# Altium schematic sheet 6-E2p&RTC.SchDoc
size A4
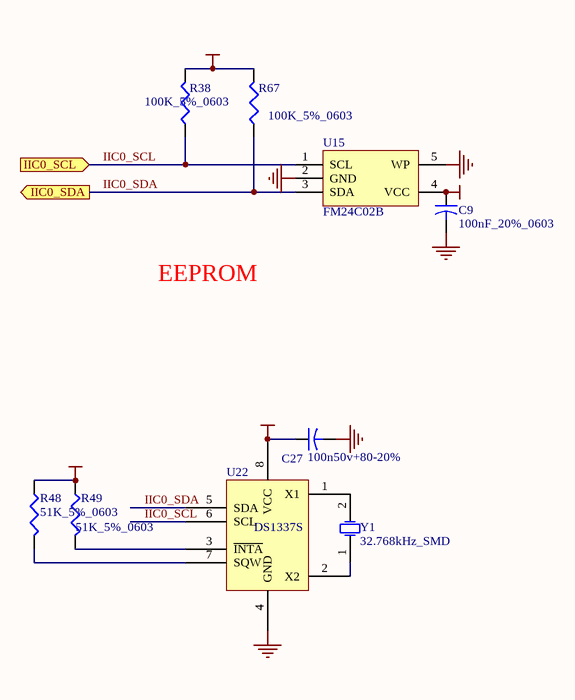
[diagram p0: 6-E2p&RTC.SchDoc]

## Parts
C9  100nF_20%_0603  [C1608-0603]
C27  value 100n50v+80-20%  [C1608-0603]  (hidden comment: Cap2)
R38  100K_5%_0603  [C1608-0603]
R48  51K_5%_0603  [C1608-0603]
R49  51K_5%_0603  [C1608-0603]
R67  100K_5%_0603  [C1608-0603]
U15  FM24C02B  [SOT23-5]
U22  DS1337S  [SO-8]
Y1  32.768kHz_SMD  [XTAL-3216]

## Ports
IIC0_SCL (in), IIC0_SDA (out)

## Nets
GND: C9.2 C27.2 U15.2(GND) U15.5(WP) U22.4(GND)
VCC_2V8: C9.1 C27.1 R38.2 R48.1 R49.1 R67.2 U15.4(VCC) U22.8(VCC)
IIC0_SCL: R38.1 U15.1(SCL) U22.6(SCL) ; port IIC0_SCL
IIC0_SDA: R67.1 U15.3(SDA) U22.5(SDA) ; port IIC0_SDA
NetR48_2: R48.2 U22.7(SQW)
NetR49_2: R49.2 U22.3(~{INTA})
NetU22_1: U22.1(X1) Y1.2(OSC2)
NetU22_2: U22.2(X2) Y1.1(OSC1)

## Notes on the sheet
- EEPROM

## Library data of the parts
C9 = Cap2: Capacitor; Value: 0.1uF 0603; Published: 23-Sep-2002; Publisher: Altium Limited
C27 = Cap2: Capacitor; Published: 23-Sep-2002; Publisher: Altium Limited
R38 R48 R49 R67 = Res3: Resistor; Value: 1K%5 0603; Published: 8-Jun-2000; Revision: July-2002: Re-released for DXP Platform.; Publisher: Altium Limited
Y1 = XTAL: Crystal Oscillator; Published: 8-Jun-2000; Revision: July-2002: Re-released for DXP Platform.; Publisher: Altium Limited